# EAGLE design KimCard-v1 (EAGLE 5.11)
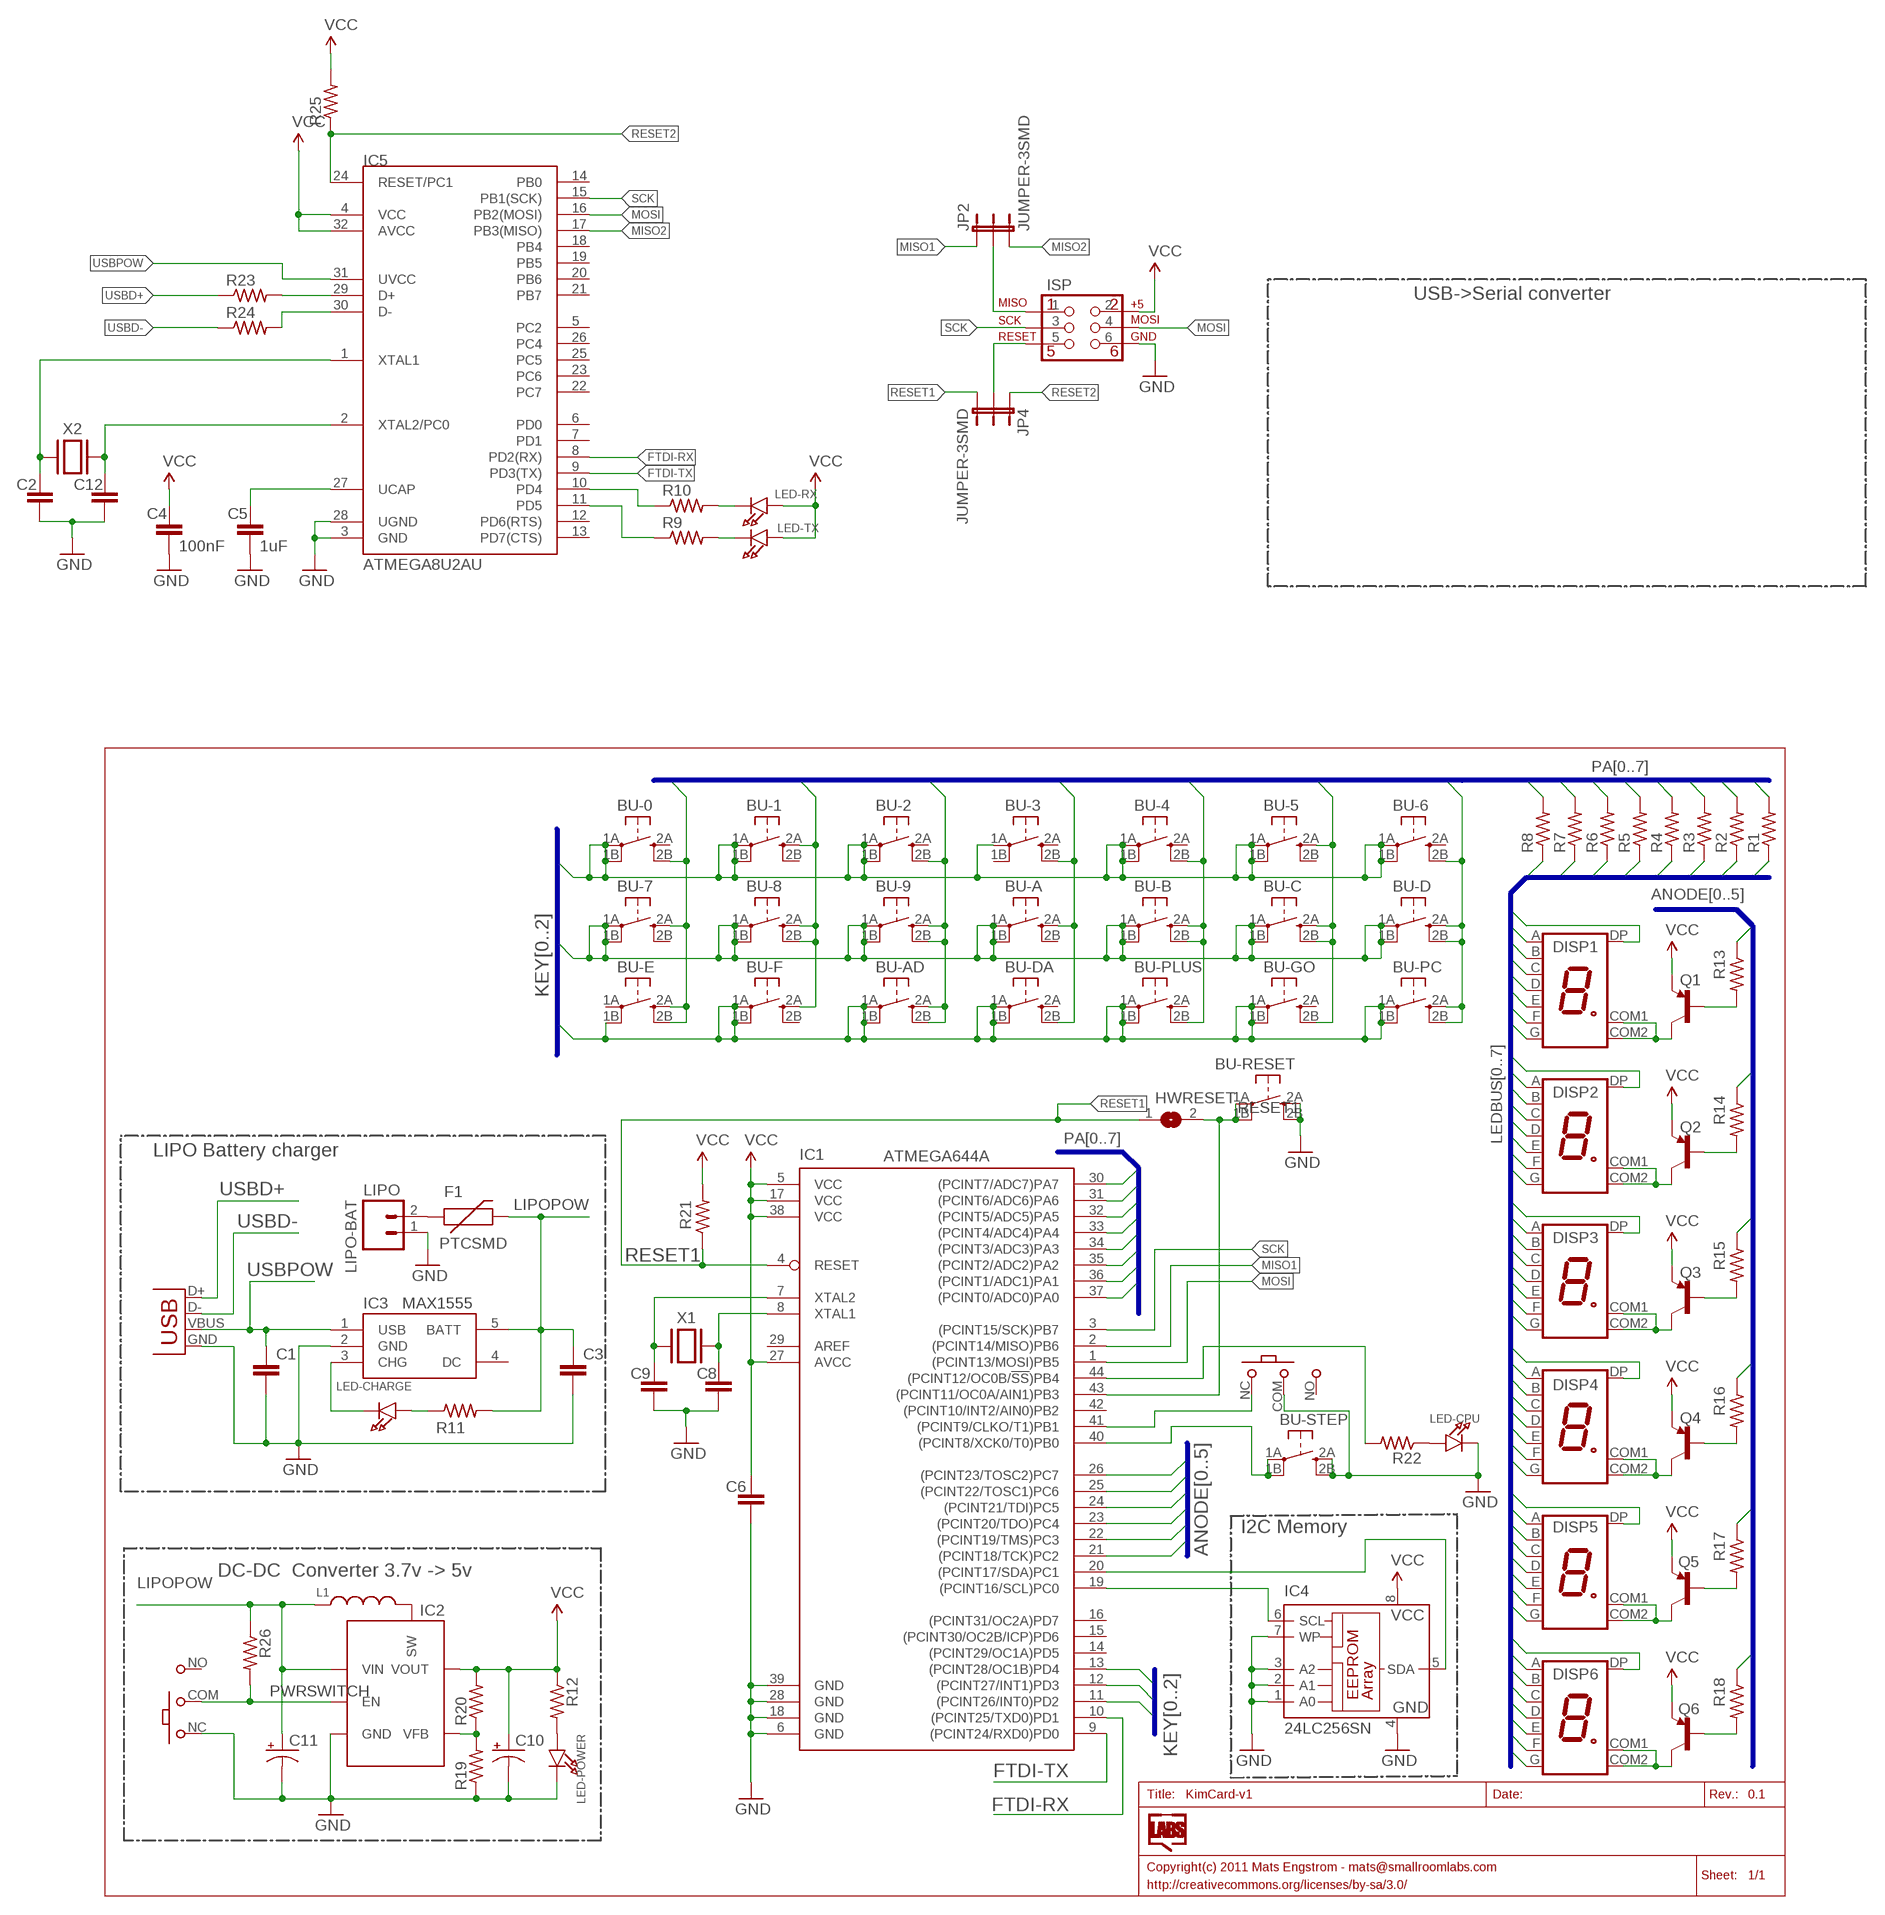
[diagram p0: schematic, sheet 1]

## Parts
BU-0  TACTILE  [EVQ-Q2]
BU-1  TACTILE  [EVQ-Q2]
BU-2  TACTILE  [EVQ-Q2]
BU-3  TACTILE  [EVQ-Q2]
BU-4  TACTILE  [EVQ-Q2]
BU-5  TACTILE  [EVQ-Q2]
BU-6  TACTILE  [EVQ-Q2]
BU-7  TACTILE  [EVQ-Q2]
BU-8  TACTILE  [EVQ-Q2]
BU-9  TACTILE  [EVQ-Q2]
BU-A  TACTILE  [EVQ-Q2]
BU-AD  TACTILE  [EVQ-Q2]
BU-B  TACTILE  [EVQ-Q2]
BU-C  TACTILE  [EVQ-Q2]
BU-D  TACTILE  [EVQ-Q2]
BU-DA  TACTILE  [EVQ-Q2]
BU-E  TACTILE  [EVQ-Q2]
BU-F  TACTILE  [EVQ-Q2]
BU-GO  TACTILE  [EVQ-Q2]
BU-PC  TACTILE  [EVQ-Q2]
BU-PLUS  TACTILE  [EVQ-Q2]
BU-RESET  TACTILE  [EVQ-Q2]
BU-STEP  TACTILE  [EVQ-Q2]
C1  CAP0805  [0805]
C2  CAP0603-CAP  [0603-CAP]
C3  CAP0805  [0805]
C4  100nF  CAP0603-CAP  [0603-CAP]
C5  1uF  CAP0603-CAP  [0603-CAP]
C6  CAP0603-CAP  [0603-CAP]
C8  CAP0603-CAP  [0603-CAP]
C9  CAP0603-CAP  [0603-CAP]
C10  CAP_POL1206  [EIA3216]
C11  CAP_POL1206  [EIA3216]
C12  CAP0603-CAP  [0603-CAP]
DISP1  7SEG  [TDS11]
DISP2  7SEG  [TDS11]
DISP3  7SEG  [TDS11]
DISP4  7SEG  [TDS11]
DISP5  7SEG  [TDS11]
DISP6  7SEG  [TDS11]
F1  PTCSMD  [PTC-1206]
HWRESET  SOLDERJUMPERREFLOW  [SOLDERJUMPER_REFLOW]
IC1  ATMEGA644A  [TQFP44]
IC2  MCP1640SOT23-6  [SOT23-6]
IC3  MAX1555  [SOT23-5]
IC4  24LC256SN  [SO-08]
IC5  ATMEGA8U2AU  [TQFP32-08]
ISP  AVR-ISP6_TOUCH  [ISP-TOUCH]
JP2  JUMPER-3SMD  [SJ_3]
JP4  JUMPER-3SMD  [SJ_3]
L1  INDUCTOR-VLCF  [VLCF]
LED-CHARGE  LEDSMD0805  [CHIPLED_0805]
LED-CPU  LEDSMD0805  [CHIPLED_0805]
LED-POWER  LEDSMD0805  [CHIPLED_0805]
LED-RX  LEDSMD0805  [CHIPLED_0805]
LED-TX  LEDSMD0805  [CHIPLED_0805]
LIPO  LIPO-BAT  M02-JST-2MM-SMT  [JST-2-SMD]
Q1  TRANSISTOR_PNPSMD  [SOT23-3]
Q2  TRANSISTOR_PNPSMD  [SOT23-3]
Q3  TRANSISTOR_PNPSMD  [SOT23-3]
Q4  TRANSISTOR_PNPSMD  [SOT23-3]
Q5  TRANSISTOR_PNPSMD  [SOT23-3]
Q6  TRANSISTOR_PNPSMD  [SOT23-3]
R1  R-US_R0805  [R0805]
R2  R-US_R0805  [R0805]
R3  R-US_R0805  [R0805]
R4  R-US_R0805  [R0805]
R5  R-US_R0805  [R0805]
R6  R-US_R0805  [R0805]
R7  R-US_R0805  [R0805]
R8  R-US_R0805  [R0805]
R9  R-US_R0805  [R0805]
R10  R-US_R0805  [R0805]
R11  R-US_R0805  [R0805]
R12  R-US_R0805  [R0805]
R13  R-US_R0805  [R0805]
R14  R-US_R0805  [R0805]
R15  R-US_R0805  [R0805]
R16  R-US_R0805  [R0805]
R17  R-US_R0805  [R0805]
R18  R-US_R0805  [R0805]
R19  R-US_R0805  [R0805]
R20  R-US_R0805  [R0805]
R21  R-US_R0805  [R0805]
R22  R-US_R0805  [R0805]
R23  R-US_R0805  [R0805]
R24  R-US_R0805  [R0805]
R25  R-US_R0805  [R0805]
R26  R-US_R0805  [R0805]
U$1  SLIDESWITCHPCM12SMTR  [PCM12SMTR]
U$2  SLIDESWITCHPCM12SMTR  [PCM12SMTR]
USB  USB-IN  USBSMD  [USB-MINIB]
X1  XTAL12SMX-B  [12SMX-B]
X2  XTAL12SMX-B  [12SMX-B]

## Nets
CHRG-A: IC3.3(CHG) LED-CHARGE.C
CHRG-B: LED-CHARGE.A R11.1
FTDI-RX: IC1.10((PCINT25/TXD0)PD1)
FTDI-TX: IC1.9((PCINT24/RXD0)PD0)
GND [pwr2]: BU-RESET.2A BU-RESET.2B BU-STEP.2A BU-STEP.2B C1.2 C2.1 C3.2 C4.2 C5.2 C6.1 C8.1 C9.1 C10.C(-) C11.C(-) C12.1 IC1.6(GND) IC1.18(GND) IC1.28(GND) IC1.39(GND) IC2.2(GND) IC3.2(GND) IC4.1(A0) IC4.2(A1) IC4.3(A2) IC4.4(GND) IC4.7(WP) IC5.3(GND) IC5.28(UGND) ISP.6(GND) LED-CPU.C LED-POWER.C LIPO.1 R19.1 U$1.NC U$2.COM USB.GND
KEYROW0: BU-0.1A BU-0.1B BU-1.1A BU-1.1B BU-2.1A BU-2.1B BU-3.1A BU-4.1A BU-4.1B BU-5.1A BU-5.1B BU-6.1A BU-6.1B IC1.11((PCINT26/INT0)PD2)
KEYROW1: BU-7.1A BU-7.1B BU-8.1A BU-8.1B BU-9.1A BU-9.1B BU-A.1A BU-A.1B BU-B.1A BU-B.1B BU-C.1A BU-C.1B BU-D.1A BU-D.1B IC1.12((PCINT27/INT1)PD3)
KEYROW2: BU-AD.1A BU-AD.1B BU-DA.1A BU-DA.1B BU-E.1B BU-F.1A BU-F.1B BU-GO.1A BU-GO.1B BU-PC.1A BU-PC.1B BU-PLUS.1A BU-PLUS.1B IC1.13((PCINT28/OC1B)PD4)
LEDBUS0: DISP1.A DISP2.A DISP3.A DISP4.A DISP5.A DISP6.A R1.1
LEDBUS1: DISP1.B DISP2.B DISP3.B DISP4.B DISP5.B DISP6.B R2.1
LEDBUS2: DISP1.C DISP2.C DISP3.C DISP4.C DISP5.C DISP6.C R3.1
LEDBUS3: DISP1.D DISP2.D DISP3.D DISP4.D DISP5.D DISP6.D R4.1
LEDBUS4: DISP1.E DISP2.E DISP3.E DISP4.E DISP5.E DISP6.E R5.1
LEDBUS5: DISP1.F DISP2.F DISP3.F DISP4.F DISP5.F DISP6.F R6.1
LEDBUS6: DISP1.G DISP2.G DISP3.G DISP4.G DISP5.G DISP6.G R7.1
LEDBUS7: DISP1.DP DISP2.DP DISP3.DP DISP4.DP DISP5.DP DISP6.DP R8.1
LEDCA0: IC1.21((PCINT18/TCK)PC2) R13.1
LEDCA1: IC1.22((PCINT19/TMS)PC3) R14.1
LEDCA2: IC1.23((PCINT20/TDO)PC4) R15.1
LEDCA3: IC1.24((PCINT21/TDI)PC5) R16.1
LEDCA4: IC1.25((PCINT22/TOSC1)PC6) R17.1
LEDCA5: IC1.26((PCINT23/TOSC2)PC7) R18.1
LIPO+ [pwr1]: F1.1 LIPO.2
LIPOPOW [pwr2]: C3.1 C11.A(+) F1.2 IC2.6(VIN) IC3.5(BATT) L1.P$1 R11.2 R26.1
MISO1: IC1.2((PCINT14/MISO)PB6) JP2.1
MISO2: IC5.17(PB3(MISO)) JP2.3
MOSI: IC1.1((PCINT13/MOSI)PB5) IC5.16(PB2(MOSI)) ISP.4(MOSI)
N$1: IC2.1(SW) L1.P$2
N$2: IC1.41((PCINT9/CLKO/T1)PB1) U$2.NC
N$3: ISP.5(RESET) JP4.2
N$4: LED-RX.C R10.2
N$5: LED-TX.C R9.2
N$6: LED-POWER.A R12.2
N$7: LED-CPU.A R22.1
N$8: IC5.29(D+) R23.2
N$9: IC5.30(D-) R24.2
N$10: C5.1 IC5.27(UCAP)
N$11: IC5.10(PD4) R10.1
N$12: IC5.11(PD5) R9.1
N$13: ISP.1(MISO) JP2.2
N$15: IC2.4(VFB) R19.2 R20.1
N$19: BU-STEP.1A BU-STEP.1B IC1.40((PCINT8/XCK0/T0)PB0)
N$23: IC1.19((PCINT16/SCL)PC0) IC4.6(SCL)
N$24: IC1.20((PCINT17/SDA)PC1) IC4.5(SDA)
N$25: IC1.44((PCINT12/OC0B/!SS!)PB4) R22.2
PA0: BU-0.2B BU-7.2A BU-E.2A BU-E.2B IC1.37((PCINT0/ADC0)PA0) R1.2
PA1: BU-1.2A BU-8.2A BU-8.2B BU-F.2A IC1.36((PCINT1/ADC1)PA1) R2.2
PA2: BU-2.2B BU-9.2A BU-9.2B BU-AD.2A BU-AD.2B IC1.35((PCINT2/ADC2)PA2) R3.2
PA3: BU-3.2B BU-A.2A BU-DA.2B IC1.34((PCINT3/ADC3)PA3) R4.2
PA4: BU-4.2B BU-B.2A BU-B.2B BU-PLUS.2B IC1.33((PCINT4/ADC4)PA4) R5.2
PA5: BU-5.2A BU-C.2A BU-C.2B BU-GO.2B IC1.32((PCINT5/ADC5)PA5) R6.2
PA6: BU-6.2B BU-D.2A BU-D.2B BU-PC.2A BU-PC.2B IC1.31((PCINT6/ADC6)PA6) R7.2
PA7: IC1.30((PCINT7/ADC7)PA7) R8.2
PWRSWITCH: IC2.3(EN) R26.2 U$1.COM
Q1B: Q1.1(B) R13.2
Q1C: DISP1.COM1(CA) DISP1.COM2(CA) Q1.3(C)
Q2B: Q2.1(B) R14.2
Q2C: DISP2.COM1(CA) DISP2.COM2(CA) Q2.3(C)
Q3B: Q3.1(B) R15.2
Q3C: DISP3.COM1(CA) DISP3.COM2(CA) Q3.3(C)
Q4B: Q4.1(B) R16.2
Q4C: DISP4.COM1(CA) DISP4.COM2(CA) Q4.3(C)
Q5B: Q5.1(B) R17.2
Q5C: DISP5.COM1(CA) DISP5.COM2(CA) Q5.3(C)
Q6B: Q6.1(B) R18.2
Q6C: DISP6.COM1(CA) DISP6.COM2(CA) Q6.3(C)
RESET1: HWRESET.1 IC1.4(RESET) JP4.3 R21.1
RESET2: IC5.24(RESET/PC1) JP4.1 R25.1
SCK: IC1.3((PCINT15/SCK)PB7) IC5.15(PB1(SCK)) ISP.3(SCK)
SOFTRESET: BU-RESET.1A BU-RESET.1B HWRESET.2 IC1.43((PCINT11/OC0A/AIN1)PB3)
USBD+: R23.1 USB.D+
USBD-: R24.1 USB.D-
USBPOW [pwr1]: C1.1 IC3.1(USB) IC5.31(UVCC) USB.VBUS
VCC [pwr1]: C4.1 C6.2 C10.A(+) IC1.5(VCC) IC1.17(VCC) IC1.27(AVCC) IC1.38(VCC) IC2.5(VOUT) IC4.8(VCC) IC5.4(VCC) IC5.32(AVCC) ISP.2(V+) LED-RX.A LED-TX.A Q1.2(E) Q2.2(E) Q3.2(E) Q4.2(E) Q5.2(E) Q6.2(E) R12.1 R20.2 R21.2 R25.2
XTAL1: C9.2 IC1.7(XTAL2) X1.XTAL1
XTAL2: C8.2 IC1.8(XTAL1) X1.XTAL2
XTAL3: C2.2 IC5.1(XTAL1) X2.XTAL1
XTAL4: C12.2 IC5.2(XTAL2/PC0) X2.XTAL2
Unconnected: BU-0.2A BU-1.2B BU-2.2A BU-3.1B BU-3.2A BU-4.2A BU-5.2B BU-6.2A BU-7.2B BU-A.2B BU-DA.2A BU-E.1A BU-F.2B BU-GO.2A BU-PLUS.2A IC1.14((PCINT29/OC1A)PD5) IC1.15((PCINT30/OC2B/ICP)PD6) IC1.16((PCINT31/OC2A)PD7) IC1.29(AREF) IC1.42((PCINT10/INT2/AIN0)PB2) IC3.4(DC) IC5.5(PC2) IC5.6(PD0) IC5.7(PD1) IC5.8(PD2(RX)) IC5.9(PD3(TX)) IC5.12(PD6(RTS)) IC5.13(PD7(CTS)) IC5.14(PB0) IC5.18(PB4) IC5.19(PB5) IC5.20(PB6) IC5.21(PB7) IC5.22(PC7) IC5.23(PC6) IC5.25(PC5) IC5.26(PC4) U$1.NO U$2.NO

## Buses
LEDBUS[0..7]
PA[0..7]
ANODE[0..5]
KEY[0..2]

## Notes on the sheet
- USB->Serial converter
- LIPO Battery charger
- I2C Memory
- DC-DC  Converter 3.7v -> 5v

## Library data of the parts
BU-0 BU-1-BU-9 BU-A BU-AD BU-B BU-C BU-D BU-DA BU-E BU-F BU-GO BU-PC BU-PLUS BU-RESET BU-STEP = SmallRoomLabs:TACTILE
C1-C6 C8 C9 C12 = SparkFun:CAP: Capacitor Standard 0603 ceramic capacitor, and 0.1" leaded capacitor.
C10 C11 = SparkFun:CAP_POL: Capacitor Polarized These are standard SMD and PTH capacitors. Normally 10uF, 47uF, and 100uF in electrolytic and tantalum varieties. Always verify the external diameter of the through hole cap, it varies with capacity, voltage, and manufacturer. The EIA devices should be standard.
DISP1-DISP6 = Nerdlabs:7SEG
F1 = SparkFun:PTC: Resettable Fuse PTC Resettable Fuse. Spark Fun Electronics SKU : COM-08357
HWRESET = microbuilder:SOLDERJUMPER: SMD Solder JUMPER Solder the two pads together to create a connection, or remove the solder to break it. REFLOW - Use this footprint for solder paste and reflow ovens. WAVE - Use this footprint for hand-soldering (larger pads).
IC1 = atmel:ATMEGA644: 8-bit Microcontroller with 64K Bytes In-System Programmable Flash Source: http://www.atmel.com/dyn/resources/prod_documents/doc2593.pdf; MPN: ATMEGA644PV-10AU; OC_FARNELL: 1455123; OC_NEWARK: 58M3748
IC2 = SmallRoomLabs:MCP1640
IC3 = SparkFun:MAX1555: MAX1555 Lithium Charger IC SOT-23 Lithium Polymer charging IC. Schematic element and footprint proven. Spark Fun Electronics SKU : COM-00674
IC4 = microchip:24*: Serial EEPROM I2C; MF: MICROCHIP; MPN: 24LC256-I/SN; OC_FARNELL: 9757996; OC_NEWARK: 27C9144
IC5 = SparkFun:ATMEGA8U2: Atmel 8-bit Microcontroller with 8/16/32K Bystes of ISP Flash and USB Controller. ATmega8U2, ATmega16U2, and ATmega32U2
ISP = SmallRoomLabs:AVR-ISP6
JP2 JP4 = SparkFun:JUMPER-3
L1 = Nerdlabs:INDUCTOR
LED-CHARGE LED-CPU LED-POWER LED-RX LED-TX = SmallRoomLabs:LED
LIPO = SparkFun:M02: Header 2 Standard 2-pin 0.1" header. Use with straight break away headers (SKU : PRT-00116), right angle break away headers (PRT-00553), swiss pins (PRT-00743), machine pins (PRT-00117), and female headers (PRT-00115). Molex polarized connector foot print use with SKU : PRT-08233 with associated crimp pins and housings.
Q1-Q6 = SparkFun:TRANSISTOR_PNP
R1-R26 = adafruit:R-US_: RESISTOR, American symbol
U$1 U$2 = Nerdlabs:SLIDESWITCH
USB = SparkFun:USB: USB Connectors USB-B-PTH is fully proven SKU : PRT-00139 USB-miniB is fully proven SKU : PRT-00587 USB-A-PCB is untested. USB-A-H is throughly reviewed, but untested. Spark Fun Electronics SKU : PRT-00437 USB-B-SMT is throughly reviewed, but untested. Needs silkscreen touching up. USB-A-S has not been used/tested USB-MB-H has not been used/tested
X1 X2 = SmallRoomLabs:XTAL

## Net classes
0 default: width 0.178 mm, drill 0.305 mm, clearance 0.178 mm
1 pwr1: width 0.178 mm, clearance 0.178 mm
2 gnd1: width 0.178 mm, clearance 0.178 mm
3 pwr2: width 0.178 mm, clearance 0.178 mm

## Board
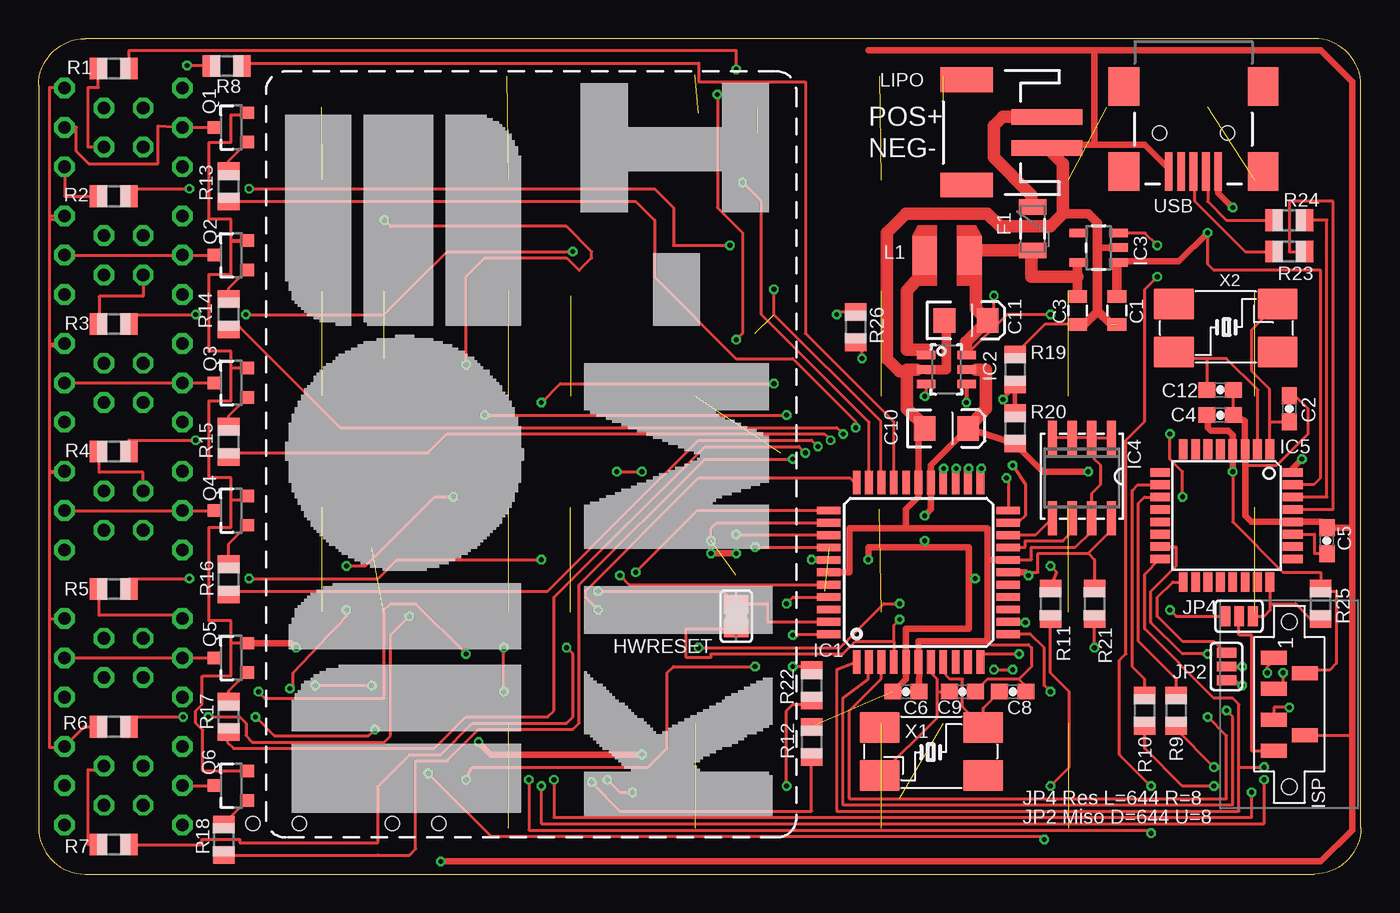
[diagram p1: board, top side]
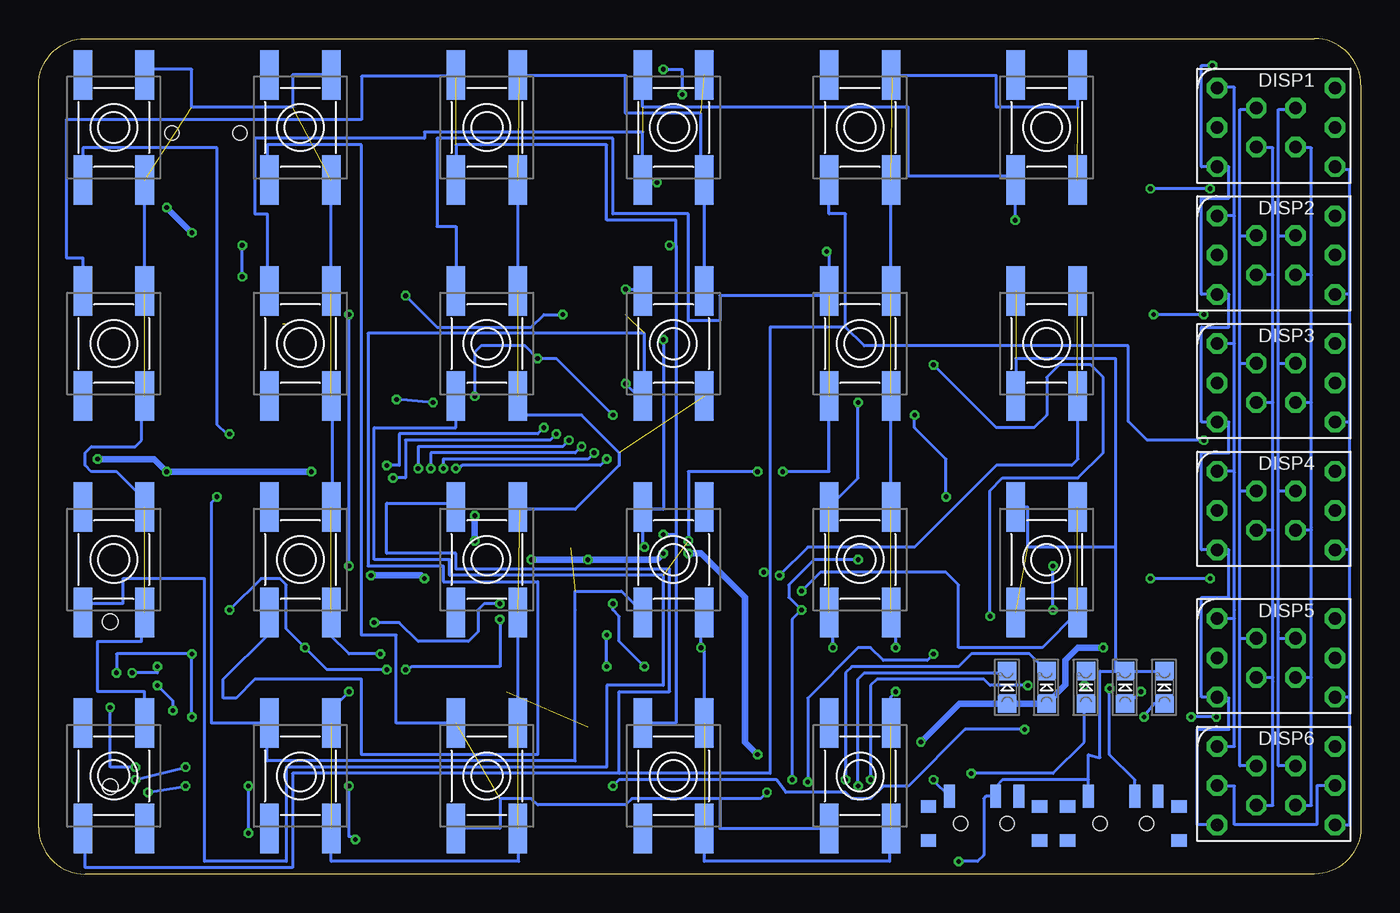
[diagram p2: board, bottom side, seen from below]

Size 85.5 x 54 mm. Coordinates in mm from the lower left corner, seen from the top.
Outline: 85.5,3 arc-90 82.5,0 3,0 arc-90 0,3 0,51 arc-90 3,54 82.5,54 arc-90 85.5,51 85.5,3
Copper layers (1*16): Top 0.035mm / dielectric 1.5mm / Bottom 0.035mm
Design rules "Fusion_eagle_rule_v1.1": minimum track width 6mil, minimum drill 12mil, track to track 6mil, track to pad 6mil, pad to pad 6mil, via to via 6mil, smd to smd 0mil, copper to edge 10mil, drill to drill 10mil, minimum pad ring 10mil, minimum via ring 6mil, stop-mask expansion 2mil, vias tented up to drill 100mil, thermal gap 10mil

### Footprints (pad centres in the part's own frame; a part is rotated, then mirrored left to right if it is on the bottom)
EVQ-Q2 = smd 3.2 x 1.2: 1A -3.4,2; 1B 3.4,2; 2A -3.4,-2; 2B 3.4,-2
0805 = smd 0.8 x 1.2: 1 -0.9,0; 2 0.9,0
0603-CAP = smd 1.1 x 1: 1 -0.85,0; 2 0.85,0
EIA3216 = smd 1.4 x 1.6: A 1.4,0; C -1.4,0
TDS11 = drill 0.813 octagon: A 1.27,1.27; B 2.54,3.81; C 1.27,-1.27; COM1 0,-3.81; COM2 0,3.81; D -1.27,-1.27; DP 2.54,-3.81; E -2.54,-3.81; F -2.54,3.81; G -1.27,1.27
PTC-1206 = smd 1 x 1.8: 1 -1.4,0; 2 1.4,0
SOLDERJUMPER_REFLOW = smd 1.168 x 1.6: 1 -0.762,0; 2 0.762,0
TQFP44 = smd 1.5 x 0.5: 1 -5.8,4; 2 -5.8,3.2; 3 -5.8,2.4; 4 -5.8,1.6; 5 -5.8,0.8; 6 -5.8,0; 7 -5.8,-0.8; 8 -5.8,-1.6; 9 -5.8,-2.4; 10 -5.8,-3.2; 11 -5.8,-4; 23 5.8,-4; 24 5.8,-3.2; 25 5.8,-2.4; 26 5.8,-1.6; 27 5.8,-0.8; 28 5.8,0; 29 5.8,0.8; 30 5.8,1.6; 31 5.8,2.4; 32 5.8,3.2; 33 5.8,4 | smd 0.5 x 1.5: 12 -4,-5.8; 13 -3.2,-5.8; 14 -2.4,-5.8; 15 -1.6,-5.8; 16 -0.8,-5.8; 17 0,-5.8; 18 0.8,-5.8; 19 1.6,-5.8; 20 2.4,-5.8; 21 3.2,-5.8; 22 4,-5.8; 34 4,5.8; 35 3.2,5.8; 36 2.4,5.8; 37 1.6,5.8; 38 0.8,5.8; 39 0,5.8; 40 -0.8,5.8; 41 -1.6,5.8; 42 -2.4,5.8; 43 -3.2,5.8; 44 -4,5.8
SOT23-6 = smd 0.55 x 1.2: 1 0.32,-1.3; 2 1.27,-1.3; 3 2.22,-1.3; 4 2.22,1.3; 5 1.27,1.3; 6 0.32,1.3
SOT23-5 = smd 0.55 x 1.2: 1 -0.95,-1.3; 2 0,-1.3; 3 0.95,-1.3; 4 0.95,1.3; 5 -0.95,1.3
SO-08 = smd 0.6 x 2.2: 1 -1.905,-2.6; 2 -0.635,-2.6; 3 0.635,-2.6; 4 1.905,-2.6; 5 1.905,2.6; 6 0.635,2.6; 7 -0.635,2.6; 8 -1.905,2.6
TQFP32-08 = smd 1.27 x 0.559: 1 -4.293,2.8; 2 -4.293,2; 3 -4.293,1.2; 4 -4.293,0.4; 5 -4.293,-0.4; 6 -4.293,-1.2; 7 -4.293,-2; 8 -4.293,-2.8; 17 4.293,-2.8; 18 4.293,-2; 19 4.293,-1.2; 20 4.293,-0.4; 21 4.293,0.4; 22 4.293,1.2; 23 4.293,2; 24 4.293,2.8 | smd 0.559 x 1.27: 9 -2.8,-4.293; 10 -2,-4.293; 11 -1.2,-4.293; 12 -0.4,-4.293; 13 0.4,-4.293; 14 1.2,-4.293; 15 2,-4.293; 16 2.8,-4.293; 25 2.8,4.293; 26 2,4.293; 27 1.2,4.293; 28 0.4,4.293; 29 -0.4,4.293; 30 -1.2,4.293; 31 -2,4.293; 32 -2.8,4.293
ISP-TOUCH = smd 0.9 x 1.7: 1 -3,-1; 2 -2,1; 3 -1,-1; 4 1,-1; 5 3,-1; 6 2,1 | hole 1: -5.334,0; 5.334,0
SJ_3 = smd 0.635 x 1.27: 1 -0.889,0; 2 0,0; 3 0.889,0
VLCF = smd 2.5 x 1.6: P$1 0,1.45; P$2 0,-1.45
CHIPLED_0805 = smd 1.2 x 1.2: A 0,-1.05; C 0,1.05
JST-2-SMD = smd 1 x 4.6: 1 -1,-3.7; 2 1,-3.7 | smd 1.6 x 3.4: NC1 -3.4,1.5; NC2 3.4,1.5
SOT23-3 = smd 0.8 x 0.9: 1 -0.95,-1; 2 0.95,-1; 3 0,1.1
R0805 = smd 1.1 x 1.4: 1 -1,0; 2 1,0
PCM12SMTR = smd 0.7 x 1.5: COM 0.75,1.75; NC -2.25,1.75; NO 2.25,1.75 | smd 1 x 0.8: P$1 -3.6,-1.1; P$2 -3.6,1.1; P$3 3.6,1.1; P$4 3.6,-1.1 | hole 0.9: -1.5,0; 1.5,0
USB-MINIB = smd 2.5 x 0.5: D+ 2.5,0; D- 2.5,0.8; GND 2.5,-1.6; ID 2.5,-0.8; VBUS 2.5,1.6 | smd 2.5 x 2: MTN1 -3,4.5; MTN2 2.5,4.5; MTN3 -3,-4.5; MTN4 2.5,-4.5 | hole 0.9: 0,2.2; 0,-2.2
12SMX-B = smd 2.6 x 2: NU1 -3.3,1.6; NU2 3.4,-1.5; XTAL1 -3.3,-1.5; XTAL2 3.4,1.6

### Placement (x,y rotation side)
BU-0  80.64,48.26 270 bottom
BU-1  80.64,34.29 270 bottom
BU-2  80.64,20.32 270 bottom
BU-3  80.64,6.35 270 bottom
BU-4  68.58,48.26 270 bottom
BU-5  68.58,34.29 270 bottom
BU-6  68.58,20.32 270 bottom
BU-7  68.58,6.35 270 bottom
BU-8  56.51,48.26 270 bottom
BU-9  56.51,34.29 270 bottom
BU-A  56.51,20.32 270 bottom
BU-AD  32.38,34.29 270 bottom
BU-B  56.51,6.35 270 bottom
BU-C  44.45,48.26 270 bottom
BU-D  44.45,34.29 270 bottom
BU-DA  32.38,48.26 270 bottom
BU-E  44.45,20.32 270 bottom
BU-F  44.45,6.35 270 bottom
BU-GO  20.32,48.26 270 bottom
BU-PC  32.38,20.32 270 bottom
BU-PLUS  32.38,6.35 270 bottom
BU-RESET  20.32,20.32 270 bottom
BU-STEP  20.32,34.29 270 bottom
C1  69.72,36.42 270 top
C2  80.87,30.07 270 top
C3  67.18,36.42 270 top
C4  76.4,29.67 0 top
C5  83.31,21.54 90 top
C6  56.08,11.79 180 top
C8  62.99,11.79 180 top
C9  59.74,11.79 180 top
C10  58.7,28.8 0 top
C11  59.97,35.79 0 top
C12  76.4,31.29 180 top
DISP1  5.49,48.26 270 bottom
DISP2  5.49,40.01 270 bottom
DISP3  5.49,31.75 270 bottom
DISP4  5.49,23.5 270 bottom
DISP5  5.49,13.97 270 bottom
DISP6  5.49,5.71 270 bottom
F1  64.28,41.71 270 top
HWRESET  45.11,16.66 90 top
IC1  56.89,19.51 90 top
IC2  58.7,33.88 270 top
IC3  68.55,40.48 90 top
IC4  67.46,25.6 180 top
IC5  76.81,23.16 270 top
ISP  80.87,10.97 270 top
JP2  76.81,13.41 90 top
JP4  77.62,16.66 180 top
L1  58.74,39.99 270 top
LED-CHARGE  17.78,12.06 0 bottom
LED-CPU  12.7,12.06 0 bottom
LED-POWER  15.24,12.06 0 bottom
LED-RX  20.32,12.06 0 bottom
LED-TX  22.86,12.06 0 bottom
LIPO  61.51,47.94 90 top
Q1  12.47,48.26 90 top
Q2  12.47,40.01 90 top
Q3  12.47,31.75 90 top
Q4  12.47,23.5 90 top
Q5  12.47,13.97 90 top
Q6  12.47,5.71 90 top
R1  4.85,52.07 0 top
R2  4.85,43.81 0 top
R3  4.85,35.56 0 top
R4  4.85,27.3 0 top
R5  4.85,18.41 0 top
R6  4.85,9.53 0 top
R7  4.85,1.91 0 top
R8  12.16,52.23 0 top
R9  73.56,10.57 270 top
R10  71.52,10.57 270 top
R11  65.43,17.48 90 top
R12  49.99,8.53 270 top
R13  12.29,44.45 90 top
R14  12.29,36.2 90 top
R15  12.29,27.94 90 top
R16  12.29,19.05 90 top
R17  12.29,10.16 90 top
R18  11.97,2.22 90 top
R19  63.14,32.61 270 top
R20  63.14,28.8 270 top
R21  68.27,17.48 90 top
R22  49.99,12.19 90 top
R23  80.87,40.23 0 top
R24  80.87,42.27 0 top
R25  82.9,17.48 90 top
R26  52.83,35.36 270 top
U$1  15.36,3.27 0 bottom
U$2  24.36,3.27 0 bottom
USB  74.67,47.9 270 top
X1  57.68,7.87 0 top
X2  76.81,35.36 180 top

### Tracks (layer width: path | path; a pad name or v marks a point on that pad's centre or on a via)
CHRG-A  (via drill 0.3)
  Top 0.178: IC3.3 71.54,41.44 v72.34,40.64 | v72.34,38.61 71.52,37.8 71.52,29.26 70.31,28.04 70.31,14.22 69.9,13.82 69.9,7.72 v71.93,5.69 | v71.93,2.64 71.73,2.85 31.7,2.85 v31.7,6.1 | v17.88,12.19 v21.54,12.19
  Bottom 0.178: v72.34,38.61 v72.34,40.64 | v71.93,2.64 v71.93,5.69 | v31.7,6.1 31.7,12.19 31.29,12.6 24.38,12.6 23.98,12.19 v21.54,12.19 | v17.88,12.19 17.88,13.01 LED-CHARGE.C
CHRG-B  (via drill 0.3)
  Top 0.178: R11.1 65.43,13.01 66.65,11.79 66.65,6.91 v65.43,5.69 | v65.02,2.23 64.82,2.44 29.26,2.44 v25.2,6.5
  Bottom 0.178: v65.43,5.69 65.43,2.44 v65.02,2.23 | v25.2,6.5 19.91,6.5 17.88,8.53 17.88,10.91 LED-CHARGE.A
GND  (via drill 0.3)  (3 unrouted)
  Top 0.178: C5.2 82.93,22.77 | C2.1 81.24,30.92 82.09,30.07 82.09,28.45 80.06,26.42 78.03,26.42 | C4.2 C12.1 | 84.94,22.35 84.9,22.39 | 84.94,8.94 81.9,8.94 ISP.6 | IC1.18 64.21,20.32 64.21,21.13 67.05,21.13 68.1,22.17 IC4.7 68.1,24.61 68.68,25.2 68.68,26.42 68.27,26.82 68.27,28.02 IC4.2 | IC4.4 IC4.3 IC4.2 | IC4.2 IC4.1 | R19.1 65.05,35.52 C3.2 | C9.1 60.59,11.82 61.36,12.6 63.4,12.6 | 63.4,12.6 63.84,12.15 C8.1 | 63.4,12.6 64.21,13.41 64.21,14.63 64.01,14.83 61.57,14.83 61.36,15.04 | 66.65,47.14 65.41,47.14 LIPO.1 | 58.7,35.79 C11.C
  Top 0.305: 56.79,32.61 IC2.2
  Top 0.406: IC3.2 68.45,40.48 68.45,40.49 | 68.45,36.42 68.49,36.39 | 82.93,22.77 IC5.28 78.43,22.77 78.03,23.16 78.03,26.42 78.03,27.44 IC5.3 78.01,29.32 C4.2 | USB.GND 73.07,45.59 71.52,47.14 68.27,47.14 | 68.27,47.14 66.65,47.14 | 67.63,35.52 C3.2 | C5.2 84.9,22.39 84.94,22.43 84.94,51.21 82.9,53.24 68.27,53.24 | 84.94,22.35 84.94,8.94 84.94,2.85 82.9,0.81 v26.01,0.81 | 61.36,20.31 61.36,15.04 56.89,15.04 IC1.6 56.96,13.64 C6.1 | 56.08,22.35 61.36,22.35 61.36,20.31 | 56.08,22.35 52.42,22.35 52.42,19.51 IC1.39 | 61.36,20.31 IC1.18 | C10.C 56.89,28.4 IC1.28 56.89,24.38 56.08,23.57 56.08,22.35 | 68.27,53.24 53.64,53.24 | 68.27,53.24 68.27,47.14
  Top 0.61: 58.7,35.79 58.7,32.61 IC2.2 | 69.35,35.52 68.49,36.39 67.63,35.52 | 68.45,36.42 68.45,40.48 68.45,42.09 67.87,42.67 66.24,42.67 | 57.3,28.93 C10.C
  Top 0.813: 56.79,32.61 56.16,32.61 56.16,32.51 | 56.16,32.51 56.16,30.07 57.3,28.93 | LIPO.1 66.24,45.91 66.24,42.67 65.43,41.86 62.18,41.86 61.36,42.67 56.08,42.67 54.86,41.45 54.86,33.33 55.68,32.51 56.16,32.51
  Bottom 0.178: LED-CPU.C LED-POWER.C 15.85,13.12 | 15.85,13.12 15.85,21.13 | 15.85,21.13 15.85,33.33 22.32,33.33 BU-STEP.2B | BU-RESET.2A 21.54,23.72 21.54,21.13 15.85,21.13 | U$1.NC 17.61,6.1 | 17.61,6.1 17.61,7.72 16.86,7.52 16.86,13.12 15.85,13.12 | 17.61,6.1 23.16,6.1 23.61,5.65 U$2.COM 24.24,5.02 24.38,4.88 24.38,1.22 24.79,0.81 v26.01,0.81
KEYROW0  (via drill 0.3)  (6 unrouted)
  Top 0.178: v63.4,14.22 60.96,14.22 60.89,14.16 IC1.11
  Bottom 0.178: 66.5,30.89 BU-5.1B | BU-2.1A 78.64,24.19 80.47,26.01 82.09,26.01 82.5,26.42 82.5,27.23 82.09,27.64 79.25,27.64 78.84,28.04 78.84,29.73 78.64,29.93 | BU-4.1A 69.09,51.66 69.09,49.58 75.59,49.58 75.59,52.02 78.64,52.02 BU-0.1A | BU-2.1B 78.84,16.92 78.84,15.04 81.68,15.04 81.68,11.79 78.64,11.79 BU-3.1A | v63.4,14.22 65.43,14.22 66.65,15.44 66.65,16.85 BU-6.1B
  Bottom 0.203: 78.64,29.93 78.94,30.23 78.94,30.59 BU-1.1B | BU-1.1A BU-0.1B | BU-5.1A BU-4.1B | 66.5,30.89 66.5,23.8 BU-6.1A | BU-0.1A 78.64,51.92
KEYROW1  (via drill 0.3)  (7 unrouted)
  Top 0.178: IC1.12 64.15,15.51 65.02,14.63 65.02,12.19 v65.43,11.79
  Bottom 0.178: BU-C.1B 42.67,44.86 42.67,49.17 47.55,49.17 47.55,51.61 54.51,51.61 BU-8.1A | 54.41,2.84 54.46,2.84 54.46,0.81 66.58,0.81 BU-7.1B | BU-A.1A 54.36,23.57 50.8,23.57 47.95,26.42 47.95,27.23 50.39,29.67 54.46,29.67 54.46,30.83 BU-9.1B | BU-7.1A 66.58,10.64 v65.43,11.79
  Bottom 0.203: 54.41,2.84 BU-B.1B | BU-B.1A BU-A.1B | BU-9.1A BU-8.1B | BU-D.1A BU-C.1B | BU-8.1A 54.42,51.56
KEYROW2  (via drill 0.3)  (6 unrouted)
  Top 0.178: IC1.13 63.75,16.31 v63.8,16.26 | v42.67,14.63 51.81,14.63 54.66,17.48 v55.68,17.48 | v30.07,11.79 v30.07,14.63
  Bottom 0.178: BU-PLUS.1B 30.22,2.95 | 18.32,50.67 18.29,50.67 18.29,49.58 23.57,49.58 23.57,51.61 30.38,51.61 BU-DA.1A | 30.22,2.79 30.48,2.79 30.48,0.81 42.45,0.81 BU-F.1B | v63.8,16.26 62.18,16.26 60.96,15.04 57.71,15.04 57.1,15.65 57.1,17.07 56.69,17.48 v55.68,17.48 | BU-E.1B 42.67,16.7 v42.67,14.63 42.45,14.41 BU-F.1A | BU-PLUS.1A 30.38,11.47 v30.07,11.79 | v30.07,14.63 30.07,16.61 BU-PC.1B
  Bottom 0.203: BU-PLUS.1B 30.22,2.79 | BU-PC.1A BU-AD.1B | BU-AD.1A BU-DA.1B | 18.32,50.67 BU-GO.1A | BU-DA.1A 30.29,51.56
LEDBUS0
  Top 0.178: DISP1.A 3.2,46.99 3.2,50.85 3.85,50.85 R1.1
  Bottom 0.178: DISP6.A 3.2,4.45 3.2,12.7 | 3.2,12.7 3.2,22.23 | 3.2,30.48 3.2,22.4 3.2,22.23 | DISP1.A 4.22,46.94 3.2,46.94 3.2,38.73 | 3.2,38.73 DISP2.A | 3.2,30.48 DISP3.A | 3.2,30.48 3.2,38.73 | 3.2,12.7 DISP5.A | 3.2,22.23 DISP4.A
LEDBUS1
  Top 0.178: R2.1 1.68,43.81 DISP1.B
  Bottom 0.178: DISP6.B 0.71,3.17 0.71,11.38 | 0.71,11.38 0.71,20.95 | 0.71,37.47 0.71,45.52 1.68,45.52 DISP1.B | DISP5.B 0.76,11.43 0.71,11.38 | 0.71,37.47 DISP2.B | 0.71,29.21 0.71,37.47 | 0.71,29.21 DISP3.B | 0.71,20.95 DISP4.B | 0.71,20.95 0.71,29.21
LEDBUS2
  Top 0.178: R3.1 3.91,35.56 3.91,37.34 6.76,37.34 DISP2.C
  Bottom 0.178: DISP6.C 5.69,4.45 5.69,12.45 5.69,12.7 | 5.69,12.7 5.69,22.23 | 5.69,38.73 5.69,46.94 6.76,46.94 DISP1.C | 5.69,38.73 DISP2.C | 5.69,30.48 5.69,38.73 | 5.69,30.48 DISP3.C | 5.69,22.23 DISP4.C | 5.69,22.23 5.69,30.48 | 5.69,12.7 DISP5.C
LEDBUS3
  Top 0.178: R4.1 3.91,27.3 3.91,25.96 6.76,25.96 DISP4.D
  Bottom 0.178: DISP6.D 7.82,6.99 7.82,15.24 | 7.82,41.27 7.82,49.43 6.76,49.43 DISP1.D | 7.82,41.27 DISP2.D | 7.82,33.02 7.82,41.27 | 7.82,33.02 DISP3.D | 7.82,24.77 7.82,33.02 | 7.82,24.77 DISP4.D | 7.82,24.77 7.82,15.29 7.82,15.24 | 7.82,15.24 DISP5.D
LEDBUS4
  Top 0.178: R5.1 3.91,18.41 3.91,16.71 9.3,16.71 DISP5.E
  Bottom 0.178: DISP6.E 8.18,8.26 8.18,16.51 | 8.18,25.96 8.18,17.07 8.18,16.51 | 8.18,25.96 8.18,34.29 | 8.18,42.55 8.18,50.85 9.3,50.85 DISP1.E | 8.18,42.55 DISP2.E | 8.18,34.29 DISP3.E | 8.18,34.29 8.18,42.55 | DISP4.E 8.25,26.04 8.18,25.96 | 8.18,16.51 DISP5.E
LEDBUS5
  Top 0.178: R6.1 2.95,9.53 DISP6.F 1.68,8.18 0.71,8.18 0.71,16.51 | 0.71,16.51 DISP5.F | 0.71,16.51 0.71,25.96 | 0.71,25.96 1.68,25.96 DISP4.F 0.71,26.04 | 0.71,25.96 0.71,26.04 | 0.71,26.04 0.71,34.14 | 0.71,34.14 1.68,34.14 DISP3.F 0.71,34.29 | 0.71,34.14 0.71,34.29 | 0.71,34.29 0.71,42.32 | 0.71,42.32 1.68,42.32 DISP2.F 0.71,42.55 | 0.71,42.32 0.71,42.55 | 0.71,42.55 0.71,50.85 1.68,50.85 DISP1.F
LEDBUS6
  Top 0.178: R7.1 3.2,1.91 3.2,6.76 4.22,6.76 DISP6.G
  Bottom 0.178: DISP6.G 5.33,6.99 5.33,15.24 | 5.33,24.77 5.33,15.65 5.33,15.24 | 5.33,41.27 5.33,49.43 4.22,49.43 DISP1.G | 5.33,41.27 DISP2.G | 5.33,33.02 DISP3.G | 5.33,33.02 5.33,41.27 | 5.33,24.77 DISP4.G | 5.33,24.77 5.33,33.02 | 5.33,15.24 DISP5.G
LEDBUS7  (via drill 0.3)  (1 unrouted)
  Top 0.178: v9.6,52.27 11.16,52.27 R8.1
  Bottom 0.178: v9.6,52.27 10.31,52.27 10.31,45.72 DISP1.DP 8.53,45.72 8.53,43.69 10.31,43.69 10.31,37.47 DISP2.DP 8.53,37.47 8.53,35.36 10.31,35.36 10.31,29.21 DISP3.DP 8.53,29.21 8.53,27.23 10.31,27.23 10.31,20.95 DISP4.DP 8.53,20.95 8.53,17.88 10.31,17.88 10.31,11.43 DISP5.DP 9.3,11.38 8.53,11.38 8.53,9.35 10.56,9.35 10.56,3.2 9.3,3.2
LEDCA0  (via drill 0.3)
  Top 0.178: R13.1 12.29,43.48 38.61,43.48 39.83,42.27 39.83,38.61 45.11,33.33 48.77,33.33 52.83,29.26 v52.83,28.85 | IC1.21 62.64,22.76 63.4,22.76 63.8,23.16 63.8,25.2 v62.99,26.42
  Bottom 0.178: v52.83,28.85 53.24,28.45 62.18,28.45 62.18,26.42 v62.99,26.42
LEDCA1  (via drill 0.3)
  Top 0.178: 12.29,35.36 R14.1 12.45,35.36 13,35.36 19.51,28.85 51.61,28.85 v52.02,28.45 | IC1.22 62.69,25.49 v62.58,25.6
  Bottom 0.178: v52.02,28.45 52.42,28.04 61.77,28.04 61.77,25.6 v62.58,25.6
LEDCA2  (via drill 0.3)
  Top 0.178: R15.1 12.29,27.23 25.2,27.23 26.41,28.45 50.8,28.45 v51.2,28.04 | 60.96,25.37 IC1.23 60.89,26.35 v60.96,26.21
  Bottom 0.178: v60.96,26.21 60.96,27.64 51.61,27.64 v51.2,28.04
LEDCA3  (via drill 0.3)
  Top 0.178: R16.1 12.29,18.29 32.92,18.29 42.67,28.04 49.99,28.04 v50.39,27.64 | 60.15,25.26 IC1.24 60.09,25.96 v60.15,26.21
  Bottom 0.178: v60.15,26.21 60.15,27.23 50.8,27.23 v50.39,27.64
LEDCA4  (via drill 0.3)
  Top 0.178: 12.29,9.35 R17.1 12.19,9.06 12.19,8.53 12.6,8.13 25.6,8.13 27.63,10.16 32.92,10.16 33.32,10.57 33.32,17.88 43.08,27.64 49.17,27.64 v49.58,27.23 | 59.33,25.27 IC1.25 59.29,26.38 v59.33,26.21
  Bottom 0.178: v59.33,26.21 59.33,26.82 49.99,26.82 v49.58,27.23
LEDCA5  (via drill 0.3)
  Top 0.178: R18.1 21.94,1.22 23.98,1.22 24.38,1.63 24.38,7.32 26.41,7.32 28.45,9.35 34.54,9.35 34.95,9.75 34.95,18.69 43.08,26.82 v48.77,26.82 | 58.52,25.28 IC1.26 58.49,26.19 v58.52,26.21
  Bottom 0.178: v58.52,26.21 58.32,26.21 58.11,26.42 49.17,26.42 v48.77,26.82
LIPO+
  Top 0.813: LIPO.2 62.35,48.94 61.77,48.36 61.77,46.33 64.21,43.89 64.21,43.17 F1.1
LIPOPOW  (via drill 0.3)
  Top 0.178: IC2.6 62.6,36.17 v65.43,36.17 | v65.43,19.91 65.84,19.51 R11.2 | R26.1 51.8,36.36 v51.61,36.17 | v61.77,37.39 61.77,36.19 C11.A
  Top 0.305: 60.6,40.23 60.19,40.23 L1.P$1 | IC2.6 60,33.85 59.97,33.88
  Top 0.406: 67.18,39.47 IC3.5 | 60.19,40.23 60.19,41.28 | 60.6,40.23 60.68,40.31
  Top 0.61: C3.1 67.18,38.61 67.18,39.47 | 60.19,41.28 59.97,41.5
  Top 0.813: 59.97,33.88 59.97,34.39 C11.A 60.6,36.55 60.6,40.23 | 60.68,40.31 F1.2 64.21,40.24 64.21,38.61 67.18,38.61
  Bottom 0.178: v65.43,19.91 v65.43,36.17 | v51.61,36.17 52.83,36.17 53.64,35.36 59.74,35.36 v61.77,37.39
MISO1  (via drill 0.3)
  Top 0.178: IC1.2 53.64,13.66 53.64,12.6 52.02,11.38 52.02,4.47 77.21,4.47 77.21,10.16 v76.81,10.57 | v77.82,12.19 77.29,12.52 JP2.1
  Bottom 0.178: v76.81,10.57 76.81,11.18 v77.82,12.19
MISO2
  Top 0.178: JP2.3 76.73,14.3 76,15.04 73.96,15.04 72.34,16.66 72.34,17.88 73.33,18.87 IC5.17
MOSI  (via drill 0.3)
  Top 0.178: 52.83,13.64 IC1.1 51.61,13.24 51.61,4.06 77.62,4.06 77.62,6.91 | 72.34,20.36 IC5.16 71.52,19.37 71.52,15.85 76,11.38 77.21,11.38 77.62,10.97 77.62,6.91 | v80.87,10.77 79.87,10.77 ISP.4 | 77.62,6.91 v79.25,6.91
  Bottom 0.178: v79.25,6.91 80.87,6.91 v80.87,10.77
N$1
  Top 0.305: IC2.1 57.43,33.56 57.43,33.88
  Top 0.813: 57.43,33.88 56.16,33.88 56.16,37.69 57.29,38.96 L1.P$2
N$2  (via drill 0.3)
  Top 0.178: IC1.41 48.79,17.91 v48.36,17.48 | v46.33,13.41 41.04,13.41 40.64,13.01 40.64,8.13 39.42,6.91 28.04,6.91 v27.63,6.1
  Bottom 0.178: v27.63,6.1 27.63,6.04 U$2.NC | v48.36,17.48 48.36,17.07 47.95,16.66 47.95,15.04 v46.33,13.41
N$3
  Top 0.178: ISP.5 78.43,7.97 78.43,15.44 77.62,15.44 JP4.2
N$4  (via drill 0.3)
  Top 0.178: v78.43,5.28 78.43,3.66 33.32,3.66 v33.32,6.1 | R10.2 71.52,8.13 73.96,5.69 v76,5.69
  Bottom 0.178: v78.43,5.28 v76,5.69 | v33.32,6.1 33.32,13.01 32.92,13.41 26.01,13.41 25.2,14.22 21.43,14.22 LED-RX.C
N$5  (via drill 0.3)
  Top 0.178: R9.2 73.56,9.35 v76,6.91 | v79.25,6.1 79.25,3.25 32.51,3.25 v32.51,5.69
  Bottom 0.178: v79.25,6.1 v76,6.91 | v32.51,5.69 32.51,12.6 32.1,13.01 22.97,13.01 LED-TX.C
N$6  (via drill 0.3)
  Top 0.178: R12.2 49.99,4.06 37.59,4.06 v35.76,5.94 | v27.63,14.22 24.38,17.48 22.76,17.48 22.35,17.07 22.35,11.38 14.63,11.38 v14.22,11.79
  Bottom 0.178: v35.76,5.94 35.76,11.38 32.51,14.63 31.7,14.63 30.88,13.82 28.04,13.82 v27.63,14.22 | v14.22,11.79 14.99,11.02 LED-POWER.A
N$7  (via drill 0.3)
  Top 0.178: v14.02,10.16 15.24,8.94 21.33,8.94 v21.74,9.35 | v48.36,5.69 48.36,10.57 48.77,10.97 49.77,10.97 R22.1
  Bottom 0.178: LED-CPU.A 13.37,11.02 v14.02,10.16 | v48.36,5.69 47.95,6.1 37.79,6.1 37.18,5.28 33.32,5.28 32.92,4.88 31.7,4.88 30.88,5.69 29.26,5.69 25.6,9.35 v21.74,9.35
N$8
  Top 0.178: IC5.29 83.72,23.57 83.72,43.48 80.87,43.48 80.87,40.23 R23.2
N$9
  Top 0.178: R24.2 83.31,42.27 83.31,24.38 81.1,24.38 IC5.30
N$10
  Top 0.178: IC5.27 82.5,21.96 82.5,20.73 83.31,20.73 C5.1
N$11
  Top 0.178: IC5.10 71.09,25.16 70.71,24.79 70.71,13.41 71.52,12.6 R10.1
N$12
  Top 0.178: IC5.11 71.51,24.36 71.12,23.98 71.12,15.04 73.56,12.6 R9.1
N$13  (via drill 0.3)
  Top 0.178: JP2.2 v77.82,13.41 | v79.45,13.01 79.47,13.41 ISP.1
  Bottom 0.178: v79.45,13.01 77.82,13.01 v77.82,13.41
N$15  (via drill 0.3)
  Top 0.254: IC2.4 v60,30.48 v59.99,30.48 | v62.36,30.68 63.16,31.6 R19.2
  Top 0.305: R19.2 R20.1
  Bottom 0.178: v59.99,30.48 v62.36,30.68
N$19  (via drill 0.3)  (1 unrouted)
  Top 0.178: IC1.40 38.19,18.71 v37.59,19.3
  Bottom 0.178: BU-STEP.1B 18.29,30.86 18.29,26.82 18.69,26.42 23.57,26.42 28.85,21.13 35.76,21.13 v37.59,19.3
N$23
  Top 0.178: IC1.19 62.72,21.13 63.8,21.13 63.8,21.54 66.24,21.54 66.83,22.12 IC4.6
N$24
  Top 0.178: IC1.20 62.73,21.95 64.5,21.95 IC4.5
N$25  (via drill 0.3)
  Top 0.178: R22.2 49.77,13.41 v48.77,13.41 | v48.77,15.44 48.83,15.51 IC1.44
  Bottom 0.178: v48.77,13.41 v48.77,15.44
PA0  (via drill 0.3)  (1 unrouted)
  Top 0.178: R1.2 5.85,53.24 45.11,53.24 v45.11,52.02 | IC1.37 51.09,21.13 v46.33,21.13 | v45.11,34.54 45.52,34.95 45.52,41.45 43.89,43.08 v43.89,50.39 | v73.96,24.38 73.96,26.01 73.15,26.82 v73.15,28.45
  Bottom 0.178: 73.96,46.94 73.96,29.06 73.35,28.45 v73.15,28.45 | 50.8,7.32 70.71,7.32 70.71,9.62 BU-7.2A 74.32,9.75 74.32,24.03 v73.96,24.38 | v45.11,52.02 43.89,52.02 v43.89,50.39 | v46.33,21.13 46.45,21.13 BU-E.2A 46.45,23.57 45.11,23.57 v45.11,34.54 | 46.45,17.07 BU-E.2B 47.82,18.29 50.8,18.29 50.8,17.07
  Bottom 0.203: 73.96,46.94 82.64,46.94 BU-0.2B | 50.8,7.32 50.8,17.07
PA1  (via drill 0.3)  (1 unrouted)
  Top 0.178: 51.09,21.95 IC1.36 51.06,21.95 v45.11,21.95 | v44.7,40.64 41.04,40.64 41.04,43.08 39.83,44.3 v13.61,44.3 | R2.2 5.85,44.3 v9.75,44.3
  Bottom 0.178: 58.51,51.56 64.62,51.56 64.62,48.77 83.72,48.77 83.72,39.83 82.64,39.83 BU-1.2A | 56.89,47.14 58.51,47.14 BU-8.2B | 44.3,21.95 v45.11,21.95 | v44.7,40.64 44.3,40.64 | 13.41,44.3 v13.61,44.3 v9.75,44.3
  Bottom 0.203: BU-F.2A 44.3,9.75 44.3,21.95 44.3,40.64 44.3,42.27 48.77,42.27 48.77,47.14 56.89,47.14 | BU-8.2A 58.51,51.56
PA2  (via drill 0.3)  (2 unrouted)
  Top 0.178: R3.2 5.85,36.17 v10.16,36.17 | v13.41,36.17 22.35,36.17 26.41,40.23 v34.54,40.23 | 51.09,22.76 IC1.35 43.84,22.71 43.48,22.35 v43.48,21.54 | v37.39,26.01 v39.01,26.01
  Bottom 0.178: 74.78,0.81 74.78,19.1 80.06,19.1 80.06,17.48 82.64,17.48 BU-2.2B | 69.49,0.81 69.49,6.91 48.77,6.91 | BU-9.2A 58.51,41.86 59.74,41.86 59.74,47.55 48.36,47.55 48.36,42.67 43.48,42.67 43.48,35.76 41.45,35.76 41.45,37.39 34.38,37.39 BU-AD.2A 34.38,40.08 v34.54,40.23 | 48.77,12.19 45.11,12.19 45.11,19.3 58.93,19.3 58.93,20.32 63.8,20.32 63.8,28.85 58.51,28.85 BU-9.2B | v10.16,36.17 v13.41,36.17 | BU-AD.2B 34.38,26.01 v37.39,26.01 | v43.48,21.54 43.48,26.01 v39.01,26.01
  Bottom 0.203: 69.49,0.81 74.78,0.81 | 48.77,12.19 48.77,6.91
PA3  (via drill 0.3)
  Top 0.178: R4.2 5.85,28.04 v10.16,28.04 | 51.09,23.57 IC1.34 42.61,23.51 v38.61,19.51
  Bottom 0.178: 69.09,0.41 69.09,6.5 47.95,6.5 | 44.7,19.71 58.52,19.71 58.52,20.73 62.99,20.73 62.99,23.98 58.51,23.98 BU-A.2A | 33.32,35.36 38.2,35.36 38.2,19.51 v38.61,19.51 | 33.32,35.36 33.32,42.67 34.38,42.67 BU-DA.2B | 80.47,0.41 82.5,0.41 82.5,2.8 BU-3.2B | v10.16,28.04 13.82,28.04 15.04,29.26 15.04,34.14 32.1,34.14 33.32,35.36
  Bottom 0.203: 69.09,0.41 80.47,0.41 | 44.7,19.71 44.7,11.79 47.95,11.79 47.95,6.5 38.2,6.5 38.2,19.51
PA4  (via drill 0.3)  (1 unrouted)
  Top 0.178: R5.2 5.85,19.1 v9.75,19.1 | v13.61,19.1 21.94,19.1 23.16,20.32 v32.51,20.32 | IC1.33 52.83,25.24 52.47,25.6 42.67,25.6 35.36,18.29 35.36,17.88 v36.17,17.07 | v38.4,5.28 37.59,5.28 v36.78,6.1
  Bottom 0.178: BU-4.2B 70.71,44.86 70.71,47.14 64.62,47.14 64.62,15.44 62.38,15.44 62.38,9.75 61.36,9.75 BU-B.2A | v9.75,19.1 v13.61,19.1 | v32.51,20.32 35.36,20.32 36.98,18.69 36.98,17.88 v36.17,17.07 36.78,16.46 v36.78,6.1 | 41.45,4.88 41.45,2.95 BU-PLUS.2B | BU-B.2B 55.68,2.95 55.68,4.88 53.64,4.88 53.24,4.47 47.55,4.47 47.14,4.88 41.45,4.88 | 41.45,4.88 38.81,4.88 v38.4,5.28
PA5  (via drill 0.3)  (1 unrouted)
  Top 0.178: R6.2 5.85,10.16 v9.35,10.16 | 53.64,25.26 IC1.32 53.69,29.21 46.73,36.17 46.73,43.48 v45.52,44.7 | v23.98,16.66 22.76,15.44 22.76,8.94 22.35,8.53 13.82,8.53 13.41,8.94 13.41,9.75 13,10.16 v10.97,10.16 | v27.63,32.92 27.63,38.61 28.85,39.83 34.14,39.83 34.95,39.01 35.76,39.83 35.76,40.23 34.14,41.86 22.76,41.86 v22.35,42.27
  Bottom 0.178: 46.33,49.58 46.45,49.58 BU-C.2A | BU-5.2A 70.71,37.69 70.71,42.67 71.52,42.67 71.52,47.55 60.55,47.55 60.55,47.95 46.45,47.95 BU-C.2B 46.29,44.7 v45.52,44.7 | 29.26,49.58 29.26,45.11 22.32,45.11 BU-GO.2B 22.35,44.83 v22.35,42.27 | v9.35,10.16 v10.97,10.16 | v23.98,16.66 23.98,24.79 23.16,25.6 18.29,25.6 16.66,27.23 16.66,32.11 17.47,32.92 19.51,32.92 20.32,32.11 20.32,29.67 21.13,28.85 23.57,28.85 v27.63,32.92
  Bottom 0.203: 29.26,49.58 46.33,49.58 | BU-C.2B 46.73,45.15
PA6  (via drill 0.3)  (2 unrouted)
  Top 0.178: R7.2 10.56,1.91 10.56,2.23 13,2.23 13,2.03 21.94,2.03 21.94,5.69 23.98,7.72 26.01,7.72 28.04,9.75 34.14,9.75 34.54,10.16 34.54,14.22 v34.14,14.63 | IC1.31 54.46,25.27 54.46,29.26 47.55,36.17 v47.55,37.8 | v47.55,31.7 33.73,31.7 v32.51,30.48
  Bottom 0.178: 64.62,7.72 64.62,12.6 71.52,12.6 72.74,11.38 73.56,11.38 73.56,12.6 70.58,15.58 BU-6.2B | 53.24,18.9 59.33,18.9 59.33,19.91 64.21,19.91 64.21,34.95 | 46.33,34.95 46.33,32.11 BU-D.2B 46.74,30.89 v47.55,31.7 | v47.55,37.8 46.45,37.8 BU-D.2A | v32.51,30.48 32.51,25.59 BU-PC.2A | 34.13,16.66 BU-PC.2B 34.14,16.67 v34.14,14.63
  Bottom 0.203: 64.62,7.72 53.24,7.72 53.24,18.9 | 46.33,34.95 64.21,34.95 | BU-D.2B
PA7
  Top 0.178: R8.2 13.16,52.43 42.67,52.43 42.67,51.21 49.58,51.21 49.58,34.95 55.27,29.26 55.27,26.01 55.29,25.98 IC1.30
PWRSWITCH  (via drill 0.3)
  Top 0.178: IC2.3 57.4,30.98 v57.3,30.89 | v53.24,33.33 53.24,33.95 R26.2 | v28.85,29.67 v48.36,29.67 | v26.82,24.38 25.6,24.38 21.13,19.91 v19.91,19.91 | v19.91,17.07 19.91,16.66 16.46,13.01 16.46,12.19 v16.25,11.99
  Bottom 0.178: v57.3,30.89 57.3,33.73 56.89,34.14 54.05,34.14 v53.24,33.33 52.02,33.33 v48.36,29.67 | v28.85,29.67 28.85,28.85 26.82,26.82 v26.82,24.38 | v19.91,17.07 v19.91,19.91 | U$1.COM 14.61,6.08 16.25,7.72 v16.25,11.99
Q1B
  Top 0.178: R13.2 12.29,46.12 Q1.1
Q1C
  Top 0.178: DISP1.COM1 Q1.3 | DISP1.COM1 9.3,48.36 | DISP1.COM2 2.44,48.26 2.44,46.74 3.25,45.92 7.72,45.92 7.72,48.36 DISP1.COM1
Q2B
  Top 0.178: R14.2 12.29,37.87 Q2.1
Q2C
  Top 0.178: Q2.3 DISP2.COM1 DISP2.COM2
Q3B
  Top 0.178: R15.2 12.29,29.61 Q3.1
Q3C
  Top 0.178: Q3.3 DISP3.COM1 DISP3.COM2
Q4B
  Top 0.178: R16.2 12.29,21.36 Q4.1
Q4C
  Top 0.178: Q4.3 DISP4.COM1 DISP4.COM2
Q5B
  Top 0.178: R17.2 12.29,11.83 Q5.1
Q5C
  Top 0.178: Q5.3 DISP5.COM1 DISP5.COM2
Q6B
  Top 0.178: R18.2 11.97,3.26 Q6.1
Q6C
  Top 0.178: DISP6.COM1 Q6.3
  Bottom 0.178: DISP6.COM2 2.84,5.71 2.84,3.2 8.18,3.2 8.18,5.69 9.3,5.69 DISP6.COM1
RESET1  (via drill 0.3)
  Top 0.178: 55.27,13.68 IC1.4 55.29,15.04 | 55.29,15.04 52.83,15.04 52.02,14.22 43.48,14.22 43.48,14.02 41.86,14.02 41.86,15.85 45.11,15.85 HWRESET.1 | 55.29,15.04 55.29,16.08 v55.68,16.46 | v61.77,13.21 v62.99,13.21 | v68.27,14.63 R21.1 | v73.15,17.07 73.56,16.66 JP4.3
  Bottom 0.178: v55.68,16.46 55.68,13.41 61.36,13.41 v61.77,13.21 | v62.99,13.21 66.85,13.21 v68.27,14.63 69.49,15.85 69.49,18.69 69.9,19.1 71.12,19.1 v73.15,17.07
RESET2
  Top 0.178: 79.79,18.69 IC5.24 79.65,18.83 79.65,17.48 | JP4.1 79.25,16.66 79.65,17.07 79.65,17.48 | R25.1 82.28,16.48 81.28,17.48 79.65,17.48
SCK  (via drill 0.3)
  Top 0.178: ISP.3 80.47,11.97 v80.47,13.01 | v75.59,14.22 73.96,14.22 71.93,16.26 71.93,18.29 73.56,19.91 73.56,21.13 72.55,21.13 IC5.15 | IC1.3 54.49,12.64 52.42,10.57 52.42,4.88 76.81,4.88 76.81,8.94 v75.59,10.16
  Bottom 0.178: v80.47,13.01 80.47,14.22 v75.59,14.22 v75.59,10.16
SOFTRESET  (via drill 0.3)  (1 unrouted)
  Top 0.178: IC1.43 47.14,16.31 47.14,17.48 45.11,17.48 HWRESET.2 44.25,18.29 v36.17,18.29
  Bottom 0.178: BU-RESET.1B 20.61,14.63 26.01,14.63 26.01,18.69 26.82,19.51 34.95,19.51 v36.17,18.29
USBD+
  Top 0.178: R23.1 78.03,40.23 74.78,43.48 74.78,45.3 USB.D+
USBD-
  Top 0.178: R24.1 76.81,42.27 75.59,43.48 75.59,45.29 USB.D-
USBPOW  (via drill 0.3)
  Top 0.178: IC5.31 81.13,25.2 82.5,25.2 82.9,25.6 82.9,39.01 76,39.01 75.59,39.42 v75.59,41.45
  Top 0.406: C1.1 69.85,37.45 | 69.72,39.34 69.72,39.41 IC3.1 69.91,39.6 73.73,39.6 v75.59,41.45 | v77.21,43.08 76.27,44.02 USB.VBUS
  Top 0.61: 69.72,39.34 C1.1
  Bottom 0.406: v75.59,41.45 v77.21,43.08
VCC  (via drill 0.3)  (1 unrouted)
  Top 0.178: Q6.2 10.62,6.67 10.62,9.3 10.16,9.75 10.16,10.57 10.56,10.97 10.56,12.75 10.62,12.8 12.44,12.8 12.44,14.94 13.47,14.94 Q5.2 12.44,14.92 12.44,16.36 11.02,16.36 11.02,22.4 12.44,22.4 12.44,24.18 | 12.44,24.18 13.47,24.18 | 13.47,24.18 Q4.2 13.51,24.45 13.51,24.18 13.47,24.18 | 12.44,24.18 12.44,25.6 11.02,25.6 11.02,30.58 12.44,30.58 12.44,32.72 13.47,32.72 Q3.2 12.44,32.7 12.44,33.78 11.02,33.78 11.02,38.76 12.44,38.76 12.44,40.89 | 12.44,40.89 13.47,40.89 Q2.2 12.44,40.95 | 12.44,40.89 12.44,40.95 | 12.44,40.95 12.44,42.32 11.02,42.32 11.02,47.3 12.44,47.3 12.44,49.07 13.47,49.07 Q1.2 | IC1.5 56.07,13.68 | 63.8,19.51 64.62,19.51 64.62,20.73 67.87,20.73 | ISP.2 81.89,13.18 83.48,13.18 83.92,13.61 83.92,18.29 83.09,18.29 R25.2 | R25.2 82.9,18.29 | R25.2 82.9,19.51 80.47,19.51 77.21,22.76 v77.21,26.01 | IC4.8 69.37,22.23 67.87,20.73 | 67.87,20.73 68.27,20.32 R21.2
  Top 0.406: 60.6,32.61 IC2.5 | C4.1 75.59,29.63 75.59,28.85 75.79,28.65 76.94,28.65 77.21,28.38 IC5.4 v77.21,26.01 | IC5.32 81.1,26.24 v81.68,26.82 | IC1.5 56.08,13.71 56.08,15.85 60.15,15.85 60.15,19.1 | 60.15,19.1 60.15,21.13 57.3,21.13 | 57.3,21.13 53.64,21.13 v53.64,20.32 | IC1.27 57.71,25.32 | 57.3,21.13 v57.3,21.54 | IC1.17 63.8,19.51 v64.01,19.3 | 60.15,19.1 v60.55,19.1 | 57.71,25.32 57.71,26.42 C10.A R20.2 64.94,26.01 v67.87,26.01 | 57.71,25.32 57.71,23.57 v57.3,23.16 | v43.48,20.73 v45.11,20.73 | v39.01,7.72 29.26,7.72 v28.45,8.53 | Q5.2 16.37,14.92 v16.66,14.63 | IC1.38 50,20.31 v49.99,20.32 | 56.07,13.68 56.08,13.67 56.08,12.6 55.26,11.77 C6.2
  Top 0.813: 60.6,32.61 61.24,32.61 61.24,30.07 C10.A
  Bottom 0.406: v81.68,26.82 78.03,26.82 v77.21,26.01 v67.87,26.01 | v53.64,20.32 v49.99,20.32 49.97,20.31 45.53,20.31 v45.11,20.73 | v64.01,19.3 60.76,19.3 v60.55,19.1 | v57.3,21.54 v57.3,23.16 | v43.48,20.73 42.67,20.73 39.83,17.88 39.83,8.53 v39.01,7.72 | v28.45,8.53 25.97,11.02 LED-TX.A LED-RX.A 19.1,12.23 19.1,13.82 18.29,14.63 v16.66,14.63
XTAL1
  Top 0.178: 57.71,13.69 IC1.7 57.69,13.02 58.11,12.6 58.11,11.79 | 58.11,11.79 58.11,10.11 X1.XTAL1 | 58.11,11.79 C9.2
XTAL2
  Top 0.178: C8.2 61.08,10.73 X1.XTAL2 59.74,10.82 59.74,12.6 58.93,12.6 58.49,13.03 IC1.8
XTAL3
  Top 0.178: IC5.1 79.61,28.85 | C2.2 79.65,29.22 79.61,28.85 | 79.61,28.85 79.61,31.34 78.43,32.51 78.43,35.18 X2.XTAL1
XTAL4
  Top 0.178: IC5.2 78.84,27.49 78.84,31.29 76.81,33.33 75.59,33.33 | 75.59,33.33 73.84,33.33 X2.XTAL2 | C12.2 75.55,33.29 75.59,33.33

### Text on the board
tPlace: POS+ | NEG- | JP4 Res L=644 R=8 | JP2 Miso D=644 U=8
tStop: KimCard r1
_bsilk: GO | AD | C | 8 | 4 | 0 | ST | DA | D | 9 | 5 | 1 | RS | PC | E | A | 6 | 2 | CPU | PWR | CHG | RX | TX | + | F | B | 7 | 3